# Altium schematic sheet Sheet1.SchDoc
size A3; SheetNumber: 2; SheetTotal: 2
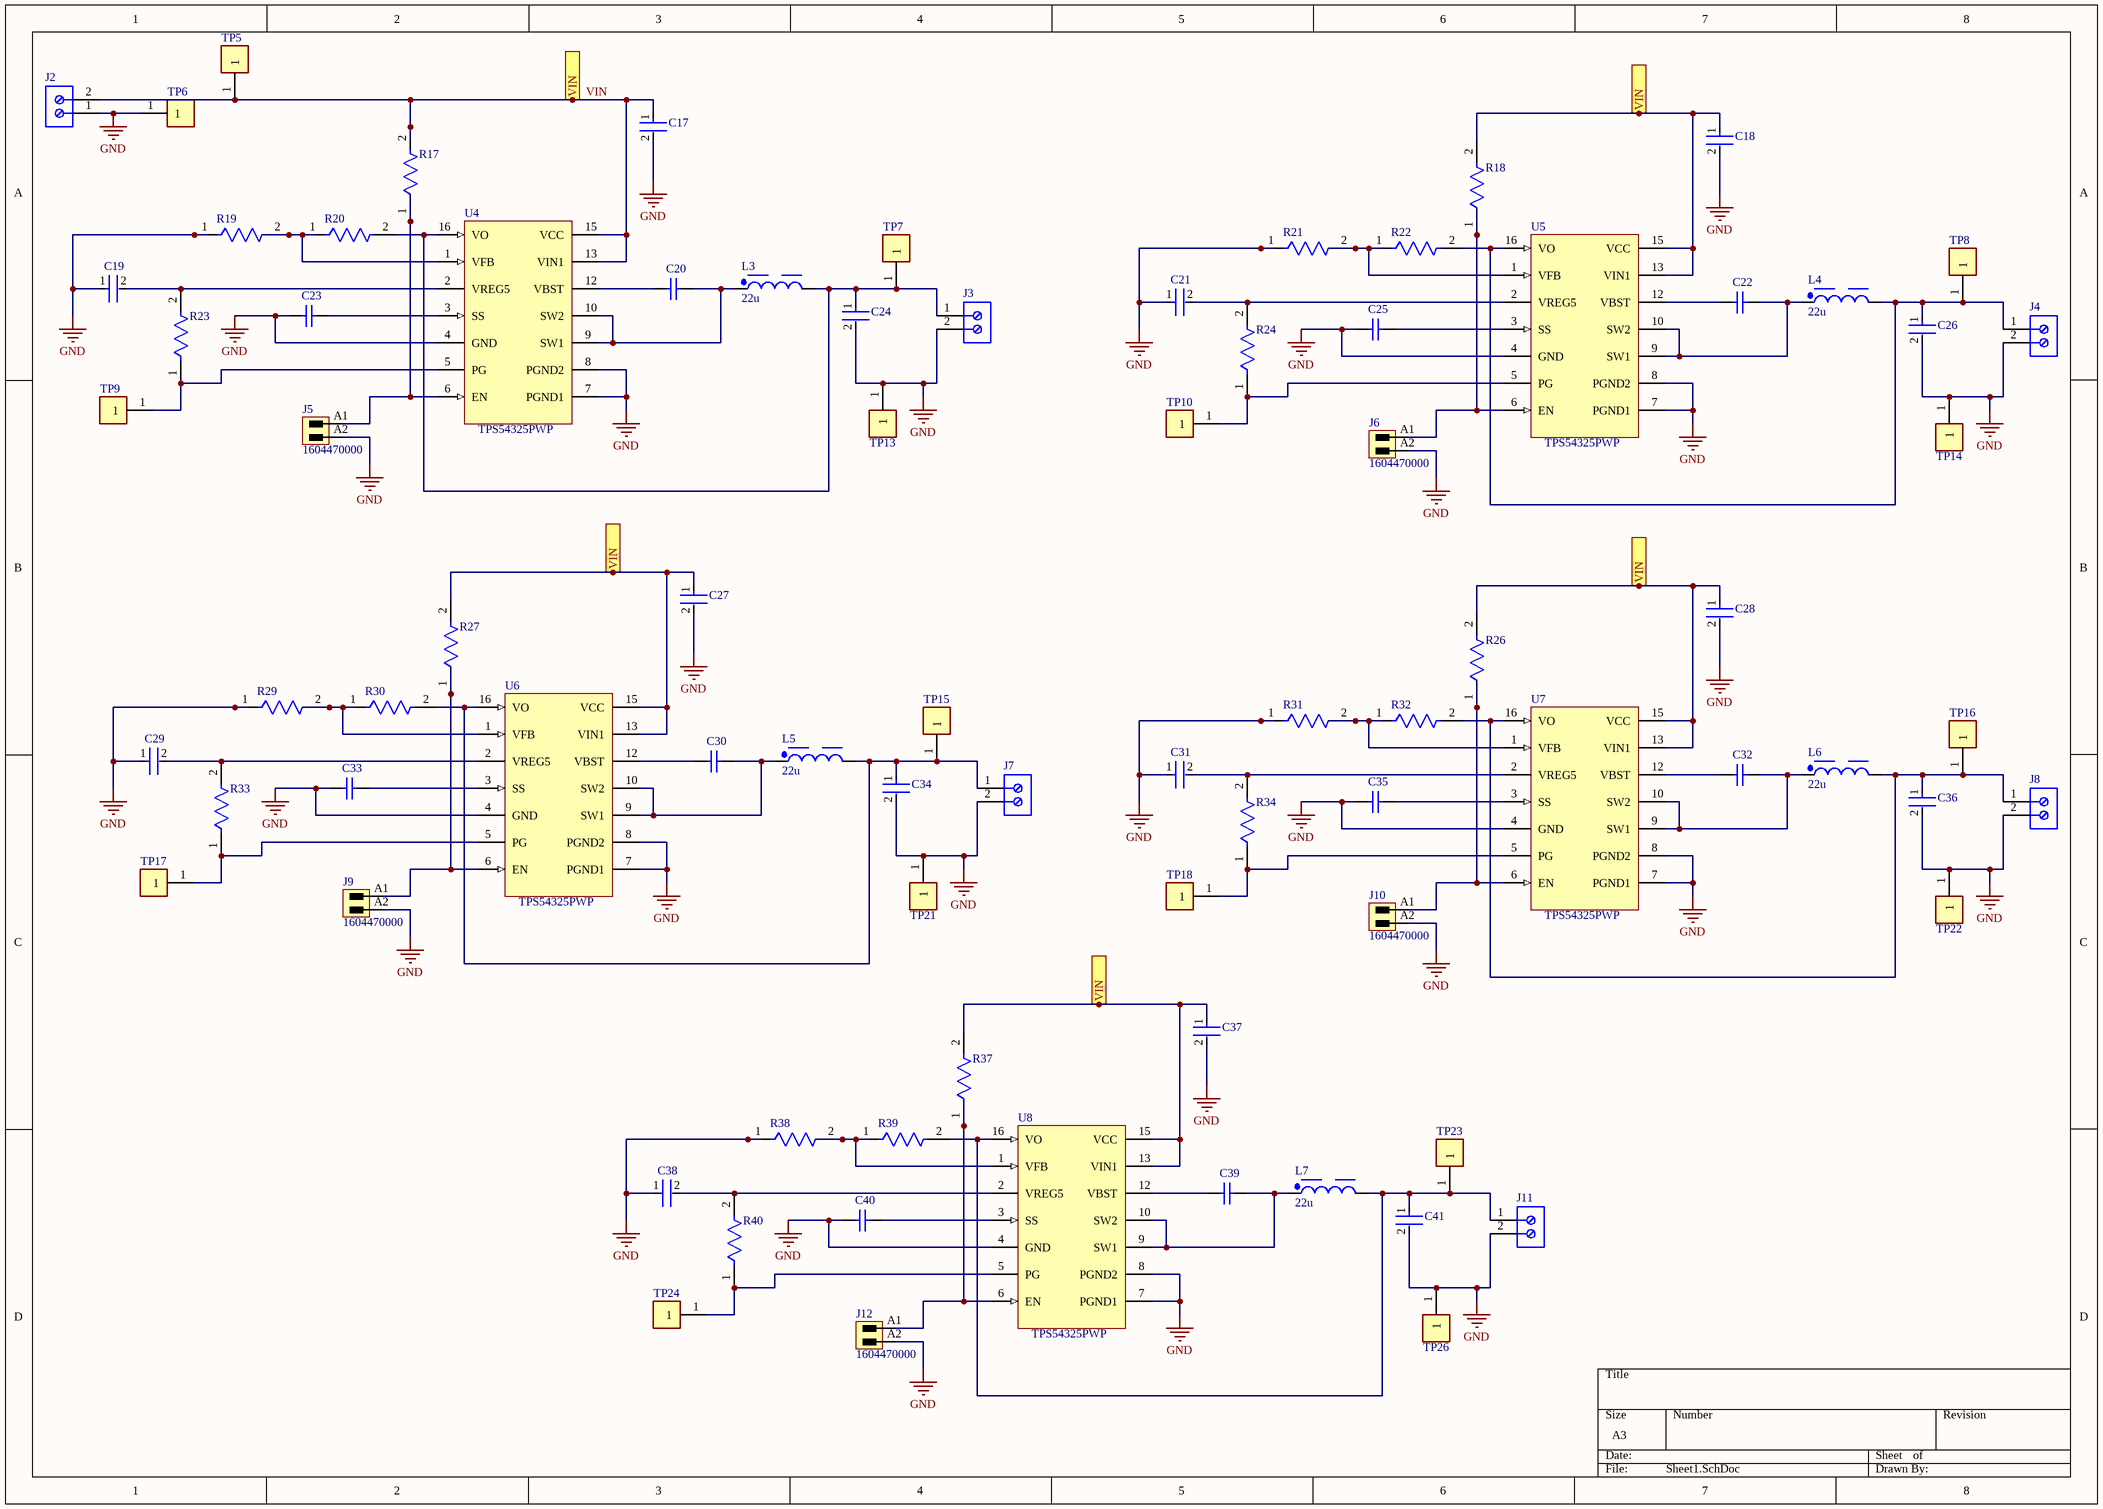
[diagram p0: Sheet1.SchDoc]

## Parts
C17  C3216X5R1C106K160AA  [FP-C3216-160-0_2-IPC_C]  (value not drawn)
C18  C3216X5R1C106K160AA  [FP-C3216-160-0_2-IPC_C]  (value not drawn)
C19  0603YC105KAT2A  [FP-0603-L_1_6_0_15-W_0_81-IPC_C]  (value not drawn)
C20  GRM188R71H104KA93D  [CAPC1608X90X35ML10T15]  (value not drawn)
C21  0603YC105KAT2A  [FP-0603-L_1_6_0_15-W_0_81-IPC_C]  (value not drawn)
C22  GRM188R71H104KA93D  [CAPC1608X90X35ML10T15]  (value not drawn)
C23  GRM188R71H104KA93D  [CAPC1608X90X35ML10T15]  (value not drawn)
C24  GRM21BR60J226ME39L  [FP-GRM21B-0_15-MFG]  (value not drawn)
C25  GRM188R71H104KA93D  [CAPC1608X90X35ML10T15]  (value not drawn)
C26  GRM21BR60J226ME39L  [FP-GRM21B-0_15-MFG]  (value not drawn)
C27  C3216X5R1C106K160AA  [FP-C3216-160-0_2-IPC_C]  (value not drawn)
C28  C3216X5R1C106K160AA  [FP-C3216-160-0_2-IPC_C]  (value not drawn)
C29  0603YC105KAT2A  [FP-0603-L_1_6_0_15-W_0_81-IPC_C]  (value not drawn)
C30  GRM188R71H104KA93D  [CAPC1608X90X35ML10T15]  (value not drawn)
C31  0603YC105KAT2A  [FP-0603-L_1_6_0_15-W_0_81-IPC_C]  (value not drawn)
C32  GRM188R71H104KA93D  [CAPC1608X90X35ML10T15]  (value not drawn)
C33  GRM188R71H104KA93D  [CAPC1608X90X35ML10T15]  (value not drawn)
C34  GRM21BR60J226ME39L  [FP-GRM21B-0_15-MFG]  (value not drawn)
C35  GRM188R71H104KA93D  [CAPC1608X90X35ML10T15]  (value not drawn)
C36  GRM21BR60J226ME39L  [FP-GRM21B-0_15-MFG]  (value not drawn)
C37  C3216X5R1C106K160AA  [FP-C3216-160-0_2-IPC_C]  (value not drawn)
C38  0603YC105KAT2A  [FP-0603-L_1_6_0_15-W_0_81-IPC_C]  (value not drawn)
C39  GRM188R71H104KA93D  [CAPC1608X90X35ML10T15]  (value not drawn)
C40  GRM188R71H104KA93D  [CAPC1608X90X35ML10T15]  (value not drawn)
C41  GRM21BR60J226ME39L  [FP-GRM21B-0_15-MFG]  (value not drawn)
J2  (no value)  [TECO-282836-2_V]
J3  (no value)  [TECO-282836-2_V]
J4  (no value)  [TECO-282836-2_V]
J5  1604470000  [SL_3_50_180G_02]
J6  1604470000  [SL_3_50_180G_02]
J7  (no value)  [TECO-282836-2_V]
J8  (no value)  [TECO-282836-2_V]
J9  1604470000  [SL_3_50_180G_02]
J10  1604470000  [SL_3_50_180G_02]
J11  (no value)  [TECO-282836-2_V]
J12  1604470000  [SL_3_50_180G_02]
L3  22u  [WE-PD_7332R]
L4  22u  [WE-PD_7332R]
L5  22u  [WE-PD_7332R]
L6  22u  [WE-PD_7332R]
L7  22u  [WE-PD_7332R]
R17  RR0816P-104-D  [FP-RR0816-IPC_A]  (value not drawn)
R18  RR0816P-104-D  [FP-RR0816-IPC_A]  (value not drawn)
R19  RR0816P-103-D  [FP-RR0816-MFG]  (value not drawn)
R20  RR0816P-203-D  [FP-RR0816-MFG]  (value not drawn)
R21  RR0816P-103-D  [FP-RR0816-MFG]  (value not drawn)
R22  RR0816P-203-D  [FP-RR0816-MFG]  (value not drawn)
R23  RR0816P-104-D  [FP-RR0816-IPC_A]  (value not drawn)
R24  RR0816P-104-D  [FP-RR0816-IPC_A]  (value not drawn)
R26  RR0816P-104-D  [FP-RR0816-IPC_A]  (value not drawn)
R27  RR0816P-104-D  [FP-RR0816-IPC_A]  (value not drawn)
R29  RR0816P-103-D  [FP-RR0816-MFG]  (value not drawn)
R30  RR0816P-203-D  [FP-RR0816-MFG]  (value not drawn)
R31  RR0816P-103-D  [FP-RR0816-MFG]  (value not drawn)
R32  RR0816P-203-D  [FP-RR0816-MFG]  (value not drawn)
R33  RR0816P-104-D  [FP-RR0816-IPC_A]  (value not drawn)
R34  RR0816P-104-D  [FP-RR0816-IPC_A]  (value not drawn)
R37  RR0816P-104-D  [FP-RR0816-IPC_A]  (value not drawn)
R38  RR0816P-103-D  [FP-RR0816-MFG]  (value not drawn)
R39  RR0816P-203-D  [FP-RR0816-MFG]  (value not drawn)
R40  RR0816P-104-D  [FP-RR0816-IPC_A]  (value not drawn)
TP5  (no value)  [FP-5000-MFG]
TP6  (no value)  [FP-5001-MFG]
TP7  (no value)  [FP-5000-MFG]
TP8  (no value)  [FP-5000-MFG]
TP9  (no value)  [FP-5000-MFG]
TP10  (no value)  [FP-5000-MFG]
TP13  (no value)  [FP-5001-MFG]
TP14  (no value)  [FP-5001-MFG]
TP15  (no value)  [FP-5000-MFG]
TP16  (no value)  [FP-5000-MFG]
TP17  (no value)  [FP-5000-MFG]
TP18  (no value)  [FP-5000-MFG]
TP21  (no value)  [FP-5001-MFG]
TP22  (no value)  [FP-5001-MFG]
TP23  (no value)  [FP-5000-MFG]
TP24  (no value)  [FP-5000-MFG]
TP26  (no value)  [FP-5001-MFG]
U4  TPS54325PWP  [RGT0016C_V]
U5  TPS54325PWP  [RGT0016C_V]
U6  TPS54325PWP  [RGT0016C_V]
U7  TPS54325PWP  [RGT0016C_V]
U8  TPS54325PWP  [RGT0016C_V]

## Ports
VIN (see Sheet1[3A], Sheet1[3B], Sheet1[5C], Sheet1[7A], Sheet1_wiekszy[7B]), VIN (see Sheet1[3A], Sheet1[3B], Sheet1[5C], Sheet1[7B], Sheet1_wiekszy[7B]), VIN (see Sheet1[3A], Sheet1[3B], Sheet1[7A], Sheet1[7B], Sheet1_wiekszy[7B]), VIN (see Sheet1[3A], Sheet1[5C], Sheet1[7A], Sheet1[7B], Sheet1_wiekszy[7B]), VIN (see Sheet1[3B], Sheet1[5C], Sheet1[7A], Sheet1[7B], Sheet1_wiekszy[7B])

## Nets
GND: C17.2 C18.2 C19.1 C21.1 C23.1 C24.2 C25.1 C26.2 C27.2 C28.2 C29.1 C31.1 C33.1 C34.2 C35.1 C36.2 C37.2 C38.1 C40.1 C41.2 J2.1 J3.2 J4.2 J5.A2 J6.A2 J7.2 J8.2 J9.A2 J10.A2 J11.2 J12.A2 R19.1 R21.1 R29.1 R31.1 R38.1 TP6.1 TP13.1 TP14.1 TP21.1 TP22.1 TP26.1 U4.4(GND) U4.7(PGND1) U4.8(PGND2) U5.4(GND) U5.7(PGND1) U5.8(PGND2) U6.4(GND) U6.7(PGND1) U6.8(PGND2) U7.4(GND) U7.7(PGND1) U7.8(PGND2) U8.4(GND) U8.7(PGND1) U8.8(PGND2)
VIN: C17.1 C18.1 C27.1 C28.1 C37.1 J2.2 R17.2 R18.2 R26.2 R27.2 R37.2 TP5.1 U4.13(VIN1) U4.15(VCC) U5.13(VIN1) U5.15(VCC) U6.13(VIN1) U6.15(VCC) U7.13(VIN1) U7.15(VCC) U8.13(VIN1) U8.15(VCC) ; port VIN
NetC19_2: C19.2 R23.2 U4.2(VREG5)
NetC20_1: C20.1 U4.12(VBST)
NetC20_2: C20.2 L3.1 U4.9(SW1) U4.10(SW2)
NetC21_2: C21.2 R24.2 U5.2(VREG5)
NetC22_1: C22.1 U5.12(VBST)
NetC22_2: C22.2 L4.1 U5.9(SW1) U5.10(SW2)
NetC23_2: C23.2 U4.3(SS)
NetC24_1: C24.1 J3.1 L3.2 R20.2 TP7.1 U4.16(VO)
NetC25_2: C25.2 U5.3(SS)
NetC26_1: C26.1 J4.1 L4.2 R22.2 TP8.1 U5.16(VO)
NetC29_2: C29.2 R33.2 U6.2(VREG5)
NetC30_1: C30.1 U6.12(VBST)
NetC30_2: C30.2 L5.1 U6.9(SW1) U6.10(SW2)
NetC31_2: C31.2 R34.2 U7.2(VREG5)
NetC32_1: C32.1 U7.12(VBST)
NetC32_2: C32.2 L6.1 U7.9(SW1) U7.10(SW2)
NetC33_2: C33.2 U6.3(SS)
NetC34_1: C34.1 J7.1 L5.2 R30.2 TP15.1 U6.16(VO)
NetC35_2: C35.2 U7.3(SS)
NetC36_1: C36.1 J8.1 L6.2 R32.2 TP16.1 U7.16(VO)
NetC38_2: C38.2 R40.2 U8.2(VREG5)
NetC39_1: C39.1 U8.12(VBST)
NetC39_2: C39.2 L7.1 U8.9(SW1) U8.10(SW2)
NetC40_2: C40.2 U8.3(SS)
NetC41_1: C41.1 J11.1 L7.2 R39.2 TP23.1 U8.16(VO)
NetJ5_A1: J5.A1 R17.1 U4.6(EN)
NetJ6_A1: J6.A1 R18.1 U5.6(EN)
NetJ9_A1: J9.A1 R27.1 U6.6(EN)
NetJ10_A1: J10.A1 R26.1 U7.6(EN)
NetJ12_A1: J12.A1 R37.1 U8.6(EN)
NetR19_2: R19.2 R20.1 U4.1(VFB)
NetR21_2: R21.2 R22.1 U5.1(VFB)
NetR23_1: R23.1 TP9.1 U4.5(PG)
NetR24_1: R24.1 TP10.1 U5.5(PG)
NetR29_2: R29.2 R30.1 U6.1(VFB)
NetR31_2: R31.2 R32.1 U7.1(VFB)
NetR33_1: R33.1 TP17.1 U6.5(PG)
NetR34_1: R34.1 TP18.1 U7.5(PG)
NetR38_2: R38.2 R39.1 U8.1(VFB)
NetR40_1: R40.1 TP24.1 U8.5(PG)

## Library data of the parts
C17 C18 C27 C28 C37 = CMP-08246-003443-1: Multilayer Ceramic Capacitors 10uF ±10% 16V X5R SMD 1206; Packaging: Tape and Reel; Thickness: 0.071inch; REACH SVHC: No SVHC; Lead Free: Lead Free; Voltage: 16V; Case Code (Imperial): 1206; RoHS Compliant: Yes; Dielectric Material: Ceramic; Termination: SMD/SMT; Resistor Type: Ceramic; Dielectric: X5R; Width: 0.063inch; Construction: Flat; Length: 3.2mm; Voltage Rating (DC): 16V; Case/Package: 1206; Series: C; Package Quantity: 1; Weight: 0.000571oz; Height: 1.6mm; Voltage Rating: 16V; Tolerance: 10%; Case Code (Metric): 3216; Max Operating Temperature: 85°C; Mount: Surface Mount; Min Operating Temperature: -55°C; Depth: 1.6mm; Radiation Hardening: No; Capacitance: 10uF
C19 C21 C29 C31 C38 = CMP-2006-04499-2: General Purpose Ceramic Capacitor, 0603, 1uF, 10%, X7R, 15%, 16V; Dissipation Factor: 3.5%; Insulation Resistance: 100GR; Radiation Hardening: No; Case Code (Metric): 1608; REACH SVHC: No SVHC; Width: 0.032inch; Dielectric: X7R; Contact Plating: Tin; Case Code (Imperial): 0603; Thickness: 0.035inch; Max Operating Temperature: 125°C; Capacitance: 1uF; Depth: 0.81mm; Voltage Rating: 16V; Mount: Surface Mount; Series: -; Length: 1.6mm; Termination: SMD/SMT; Tolerance: 10%; Case/Package: 0603; Packaging: Tape and Reel; Dielectric Material: Ceramic; RoHS Compliant: Yes; Voltage: 16V; Min Operating Temperature: -55°C; Height: 0.94mm; Voltage Rating (DC): 16V; Lead Free: Lead Free; Package Quantity: 1; Construction: Flat
C20 C22 C23 C25 C30 C32 C33 C35 C39 C40 = CMP-2100-03643-1: Chip Capacitor, 0.1 uF, +/- 10%, 50 V, -55 to 125 degC, 0603 (1608 Metric), RoHS, Tape and Reel; Manufacturer: Murata; Dielectric Material: Ceramic; Voltage Rating: 50V; Capacitance: 100nF; Dielectric: X7R; Insulation Resistance: 10GR; Case Code (Metric): 1608; Lead Free: LeadFree; Depth: 0.8mm; Number of Pins: 2; Radiation Hardening: No; Case/Package: 0603; Manufacturer URL: http://www.murata.com/; Packaging: TapeandReel; Length: 1.6mm; Contact Plating: Tin; Datasheet URL: http://psearch.en.murata.com/capacitor/product/GRM188R71H104KA93%23.pdf; Tolerance: 10%; Case Code (Imperial): 0603; Min Operating Temperature: -55degC; RoHSCompliant: true; Voltage: 50V; Termination: SMD/SMT; Mount: SurfaceMount; Material: Ceramic; Package Quantity: 1; Height: 0.8mm; Thickness: 0.035inch; REACH SVHC: NoSVHC; Max Operating Temperature: 125degC; Width: 0.8mm; Package Reference: 0603; Voltage Rating (DC): 50V; Datasheet Version: 42675.0; Package Description: 2-Pin Surface Mount Device, Body 1.6 x 0.8 mm
C24 C26 C34 C36 C41 = CMP-2007-03385-2: Chip Multilayer Ceramic Capacitors for General Purpose, 0805, 22uF, X5R, 15%, 20%, 6.3V; Material: Ceramic; Max Operating Temperature: 85°C; Voltage: 6.3V; Min Operating Temperature: -55°C; Case/Package: 0805; Thickness: 0.053inch; Dielectric: X5R; Packaging: Tape and Reel; Depth: 1.25mm; Termination: SMD/SMT; Voltage Rating (DC): 6.3V; Radiation Hardening: No; Tolerance: 20%; Mount: Surface Mount; Lead Free: Lead Free; Package Quantity: 1; REACH SVHC: No SVHC; Voltage Rating: 6.3V; Capacitance: 22uF; Length: 2mm; Case Code (Imperial): 0805; Case Code (Metric): 2012; Width: 0.049inch; Height: 1.25mm
J2-J4 J7 J8 J11 = CMP-1684-00017-1: Female Header, Pitch 5 mm, 1 x 2 Position, Height 10 mm, Tail Length 3.5 mm, Rohs, Bulk; Manufacturer: TE Connectivity; Wire Gauge: 16-30AWG; Product Training Modules: Wire-to-BoardEurostyleTerminalBlocks; Clamp Material - Plating: Brass-NickelPlated; Voltage: 300V; Mating Orientation: HorizontalwithBoard; Current: 13.5A; Pitch: 0.197"(5.00mm); Screw Thread: M3; 3D Model: 282836-2.pdf; Other Names: 5ULV-02B / A98076; Dynamic Catalog: BuchananSeries; Number of Levels: 1; Torque - Screw: 0.68Nm(6Lb-In); Featured Product: EurostyleTerminalBlockConnectors; Positions Per Level: 2; Wire Termination: Screw-RisingCageClamp; Datasheet URL: http://www.te.com.cn/commerce/DocumentDelivery/DDEController?Action=showdoc&DocId=Catalog+Section%7F1308389_EUROSTYLE_TERMINAL_BLOCKS%7F0607%7Fpdf%7FEnglish%7FENG_CS_1308389_EUROSTYLE_TERMINAL_BLOCKS_0607.pdf%7F282836-2; Color: Green; Family: TerminalBlocks-WiretoBoard; RoHS Information: 282836-2StatementofCompliance; Standard Package: 300; Contact Material - Plating: Brass-TinPlated; Manufacturer URL: http://www.te.com; Housing Material: Polyamide(PA66),Nylon6/6; Features: Interlocking(Side); Package Description: Female Header, Pitch 5 mm, 1 x 2 Position, Height 10 mm, Tail Length 3.5 mm; Mounting Type: ThroughHole; Package Reference: THD; Packaging: Bulk; Series: Buchanan; Category: Connectors,Interconnects; Screw Material - Plating: Brass-NickelPlated
J5 J6 J9 J10 J12 = CMP-1559-00901-1: OMNIMATE Signal - series BL/SL 3.50; Manufacturer: Weidmueller; UL_94_flammability_rating: V-0; Insulating_material: PBT; Rated_current_min_no_of_poles_TU_20_deg_C: 32 A; Pitch_mm: 3.5 mm; Rated_voltage_use_group_B_UL_1059: 300 V; No_of_poles: 2; Outgoing_elbow: 180°; Side_termination_characteristic: closed side; Rated_voltage_for_surge_voltage_class_pollution_degree_II_2: 320 V; Pitch_inch: 0.138 inch; Solder_pin_length_mm: 3.2 mm; Short_text_for_material: SL 3.50/02/180G 3.2SN OR BX; Contact_material: CuSn; Rated_current_use_group_B_UL_1059: 10 A; Mounting_onto_the_PCB: Solder connection; Contact_surface: tinned; ComponentLink1Description: Manufacturer URL; ComponentLink2Description: URL Link1; Qty: 100 PCS; ComponentLink1URL: http://www.weidmueller.com/; PartNumber: 1604470000; Revision: V1; PackageReference: SL_3_50_180G_02; Packaging: Box; ComponentLink2URL: http://catalog.weidmueller.com/catalog/Start.do?localeId=en&ObjectID=1604470000; Colour: Orange
L3-L7 = CMP-1396-00043-2: NexarPartId: 8917183; Saturation Current: 4.8A; Tolerance: 20%; Inductance: 2.2µH; Self Resonant Frequency: 36MHz; Current Rating: 4.02A; Shielding: Shielded; DC Resistance (DCR): 20mΩ; Core Material: Ferrite; Resistance: 23mΩ; Test Frequency: 1kHz; Mount: Surface Mount; Termination: SMD/SMT; Number of Pins: 2; Case/Package: Nonstandard; Height: 3.2mm; Max Operating Temperature: 125°C; Ambient Temperature Range Low: -40°C; Min Operating Temperature: -40°C; Height - Seated (Max): 3.5052mm; REACH SVHC: Unknown; Weight: 4.535924g; Ambient Temperature Range High: 85°C; Max DC Current: 4.02A; Composition: Wirewound; RoHS: Compliant; Lead Pitch: 4mm; Inductance Tolerance: 20%; RMS Current (Irms): 4.02A; Series Resistance: 23mΩ; Length: 7.3mm; Width: 7.3mm; Packaging: Cut Tape (CT)
R17 R18 R23 R24 R26 R27 R33 R34 R37 R40 = CMP-2000-02426-2: 100kΩ ±0.5% 0.0625W 1/16W Chip Resistor 0603 (1608 Metric) Thin Film; Resistance: 100kR; Max Power Dissipation: 63mW; Working Voltage: 75V; Temperature Coefficient: 25ppm/°C; Technology: THIN FILM; Width: 0.8mm; Length: 1.6mm; Number of Pins: 2; Case Code (Metric): 1608; Tolerance: 0.5%; Case Code (Imperial): 0603; Resistor Type: Thin Film; Voltage Rating (DC): 75V; Lead Free: Lead Free; Max Operating Temperature: 125°C; Series: RR; Voltage Rating: 75V; Termination: SMD/SMT; Depth: 0.8mm; Power Rating: 63mW; Min Operating Temperature: -55°C; Packaging: Tape and Reel; Height: 0.4mm; Package Quantity: 1; RoHS Compliant: Yes; Number of Terminations: 2; Resistance Tolerance: 0.5%; Case/Package: 0603
R19 R21 R29 R31 R38 = CMP-2000-02424-2: 10kΩ ±0.5% 0.0625W 1/16W Chip Resistor 0603 (1608 Metric) Thin Film; Max Power Dissipation: 63mW; Voltage Rating (DC): 75V; Resistance: 10kR; Temperature Coefficient: 25ppm/°C; Termination: SMD/SMT; Package Quantity: 1; Weight: 7.1E-05oz; Resistance Tolerance: 0.5%; Case Code (Metric): 1608; Height: 0.4mm; RoHS Compliant: Yes; Number of Terminations: 2; Max Operating Temperature: 125°C; Width: 0.8mm; Resistor Type: Thin Film; Packaging: Tape and Reel; Length: 1.6mm; Min Operating Temperature: -55°C; Depth: 0.8mm; Tolerance: 0.5%; Size Code: 0603; Case/Package: 0603; Number of Pins: 2; Voltage Rating: 75V; Case Code (Imperial): 0603; Lead Free: Lead Free; Power Rating: 63mW; Series: RR; Technology: THIN FILM
R20 R22 R30 R32 R39 = CMP-2000-02528-2: 20kΩ ±0.5% 0.0625W 1/16W Chip Resistor 0603 (1608 Metric) Thin Film; Working Voltage: 75V; Max Power Dissipation: 63mW; Temperature Coefficient: 25ppm/°C; Resistance: 20kR; Case/Package: 0603; Packaging: Tape and Reel; Number of Terminations: 2; Case Code (Imperial): 0603; Package Quantity: 1; Case Code (Metric): 1608; Lead Free: Lead Free; Height: 0.4mm; Width: 0.031inch; RoHS Compliant: Yes; Tolerance: 0.5%; Min Operating Temperature: -55°C; Resistor Type: Thin Film; Max Operating Temperature: 125°C; Number of Pins: 2; Voltage Rating (DC): 75V; Resistance Tolerance: 0.5%; Depth: 0.8mm; Series: RR; Power Rating: 63mW; Length: 1.6mm; Technology: THIN FILM; Termination: SMD/SMT; Voltage Rating: 75V
TP5 TP7-TP10 TP15-TP18 TP23 TP24 = CMP-19636-000027-1: PC TEST POINT MINIATURE RED; Outside Diameter: 2.54mm; Body Material: Bronze; Number of Contacts: 1; Insulation: Insulated; Inside Diameter: 1.27mm; Hole Diameter: 1.6mm; Plating: Silver; Length: 7.62mm; Package Quantity: 100; Number of Ports: 1; Contact Material: Bronze; Orientation: Straight; RoHS Compliant: Yes; Housing Color: Red; Height: 0.3inch; Series: THM; Lead Free: Lead Free; Color: Red; Contact Plating: Tin; Mount: PCB; Packaging: Bulk; REACH SVHC: No SVHC; Flammability Rating: UL94 V-0; Material: Nylon
TP6 TP13 TP14 TP21 TP22 TP26 = CMP-2000-05181-2: PC TEST POINT MINIATURE BLACK; Body Material: Bronze; Plating: Silver; Inside Diameter: 1.27mm; Hole Diameter: 1.6mm; Number of Ports: 1; Outside Diameter: 2.54mm; Insulation: Insulated; Insulation Material: Nylon; Mount: Through Hole; RoHS Compliant: Yes; Series: THM; Height: 0.3inch; Termination: Through Hole; Material: Nylon; Packaging: Bulk; Contact Material: Bronze; REACH SVHC: No SVHC; Contact Plating: Silver; Orientation: Straight; Lead Free: Lead Free; Package Quantity: 100; Length: 7.62mm; Flammability Rating: UL94 V-0; Number of Contacts: 1; Diameter: 2.54mm; Housing Color: Black; Color: Black
U4-U8 = CMP-0323-00119-3: Buck Step Down Regulator with 4.5 to 18 V Input and 0.76 to 5.5 V Output, -40 to 85 degC, 16-Pin QFN (RGT), Green (RoHS & no Sb/Br); PartNumber: TPS54326RGTR; Manufacturer: Texas Instruments; Vout(Max)(V): 5.5; Rating: Catalog; Vin(Max)(V): 18; Iout(Max)(A): 3; SubFamily: Step-Down Regulator; Duty Cycle(Max)(%): 90; Vin(Min)(V): 4.5; Synchronous Rectification: TRUE; Iq(Typ)(mA): 0.85; Vout(Min)(V): 0.76; Switch Current Limit(Typ)(A): 3.5; Regulated Outputs(#): 1; Eco-Plan: Green (RoHS & no Sb/Br); PackageVersion: revH, Oct-2011; DatasheetVersion: SLVSA13E; ComponentLink1URL: http://www.ti.com/general/docs/lit/getliterature.tsp?genericPartNumber=TPS54326&fileType=pdf; ComponentLink2Description: Package Specification; ComponentLink3Description: URL Link1; PackageDescription: 16-Pin Plastic Quad Flat No-Lead, 3 x 3 mm Body, 0.5 mm Pitch, 1.7 x 1.7 mm Exposed Pad; Topology: Buck; ComponentLink1Description: Datasheet; ComponentLink2URL: http://www.ti.com/litv/pdf/mpqf119g; ComponentLink3URL: Samples URL:http://www.ti.com/product/tps54326#samples; PackageReference: RGT0016C; Code_JEDEC: MO-220; Mounting Technology: Surface Mount